# EasyEDA Pro project ADA4530_2025-03-15.epro, board PCB6
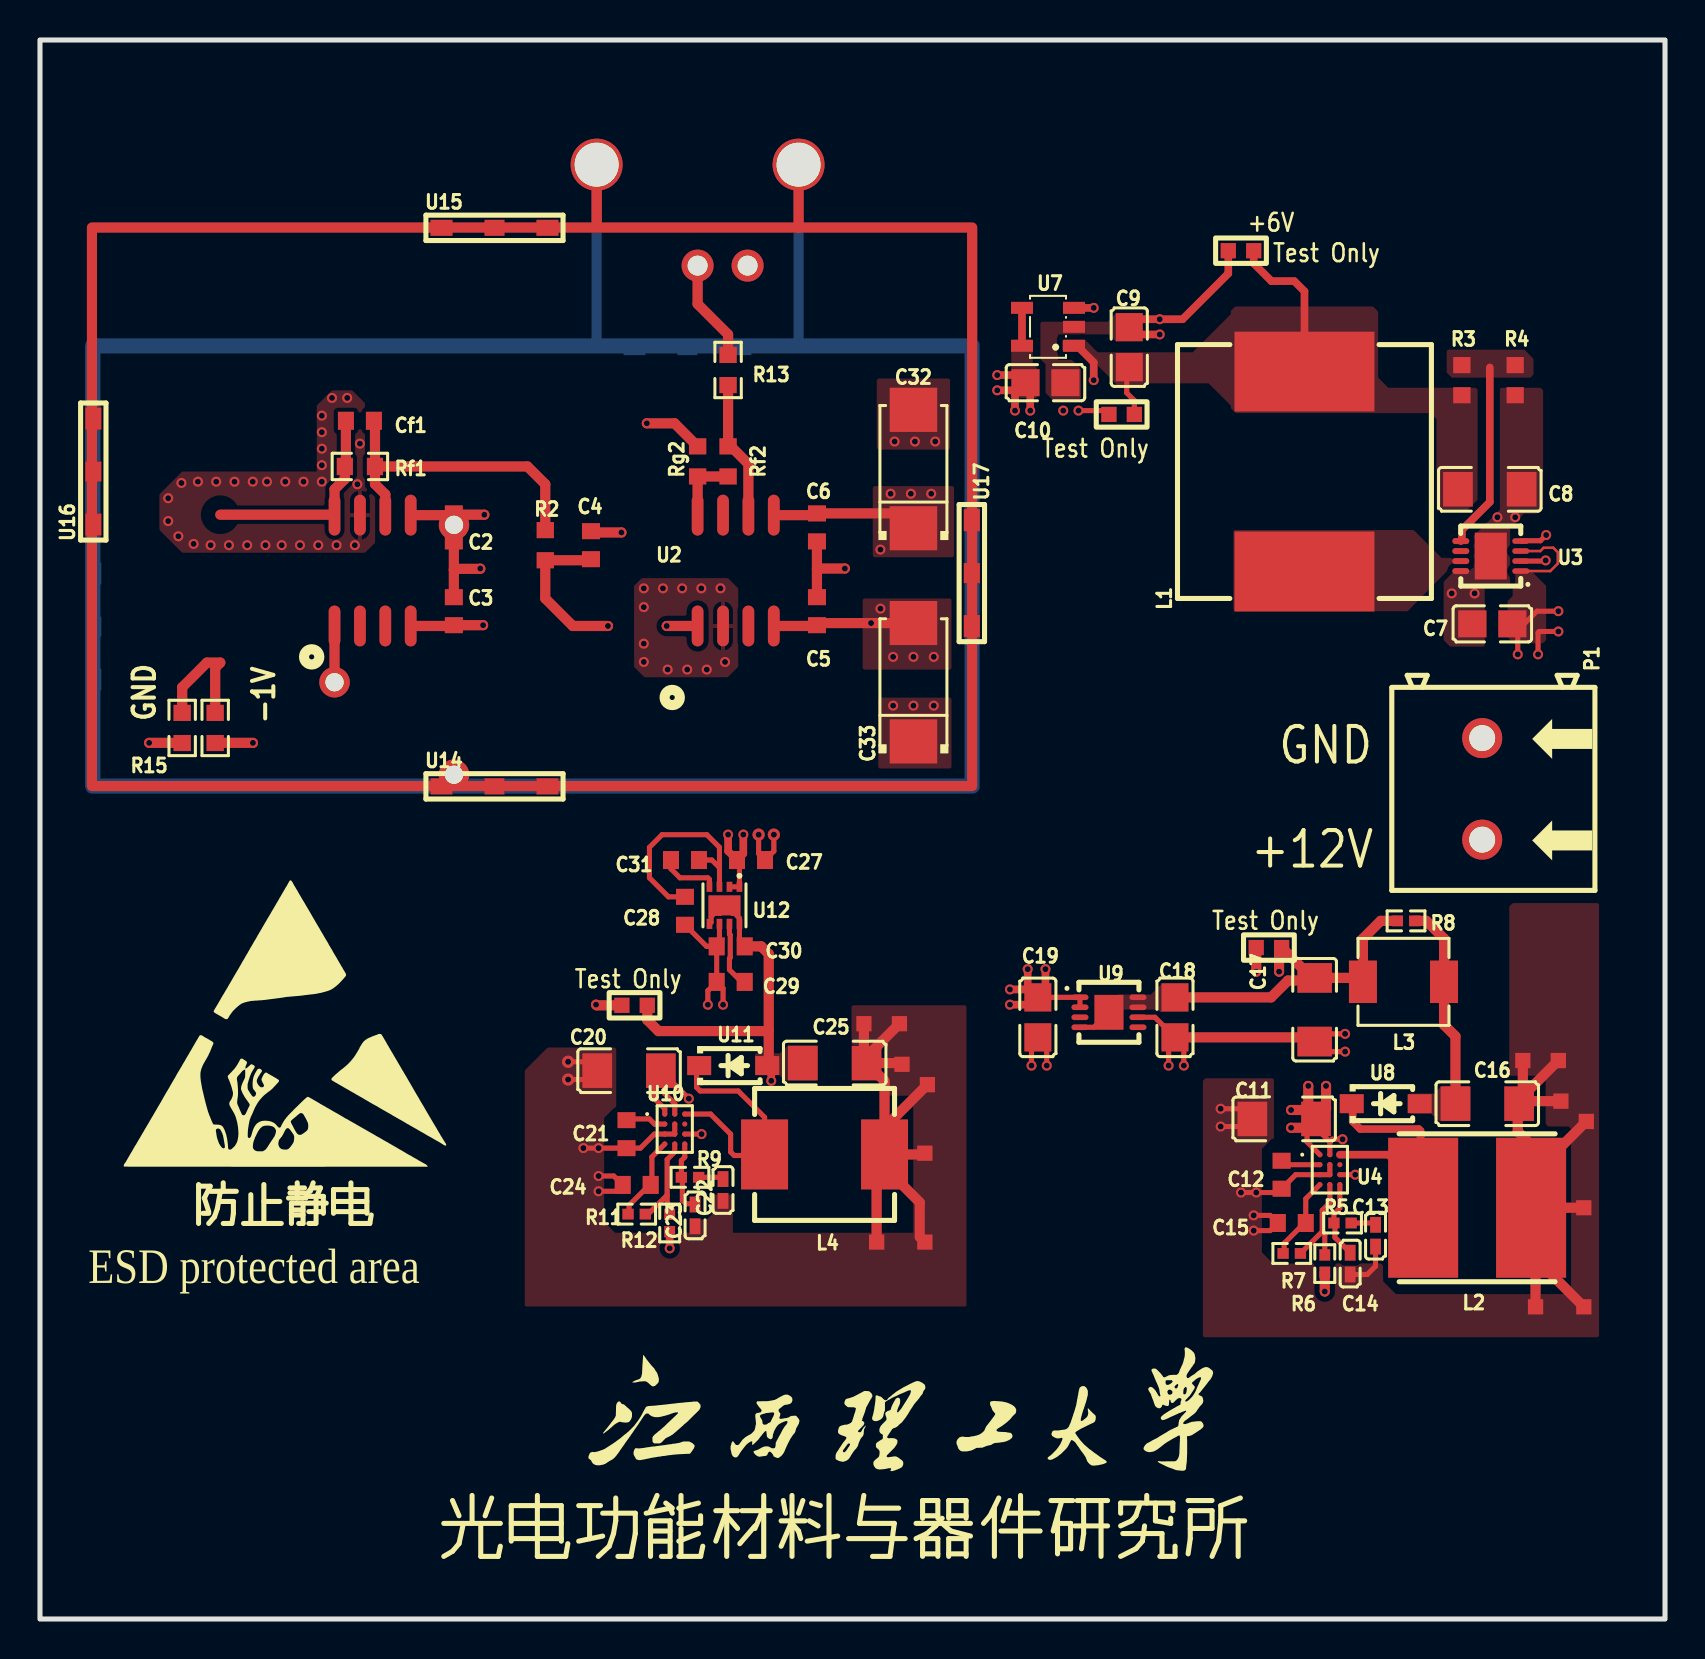
[diagram p8: board, top side]
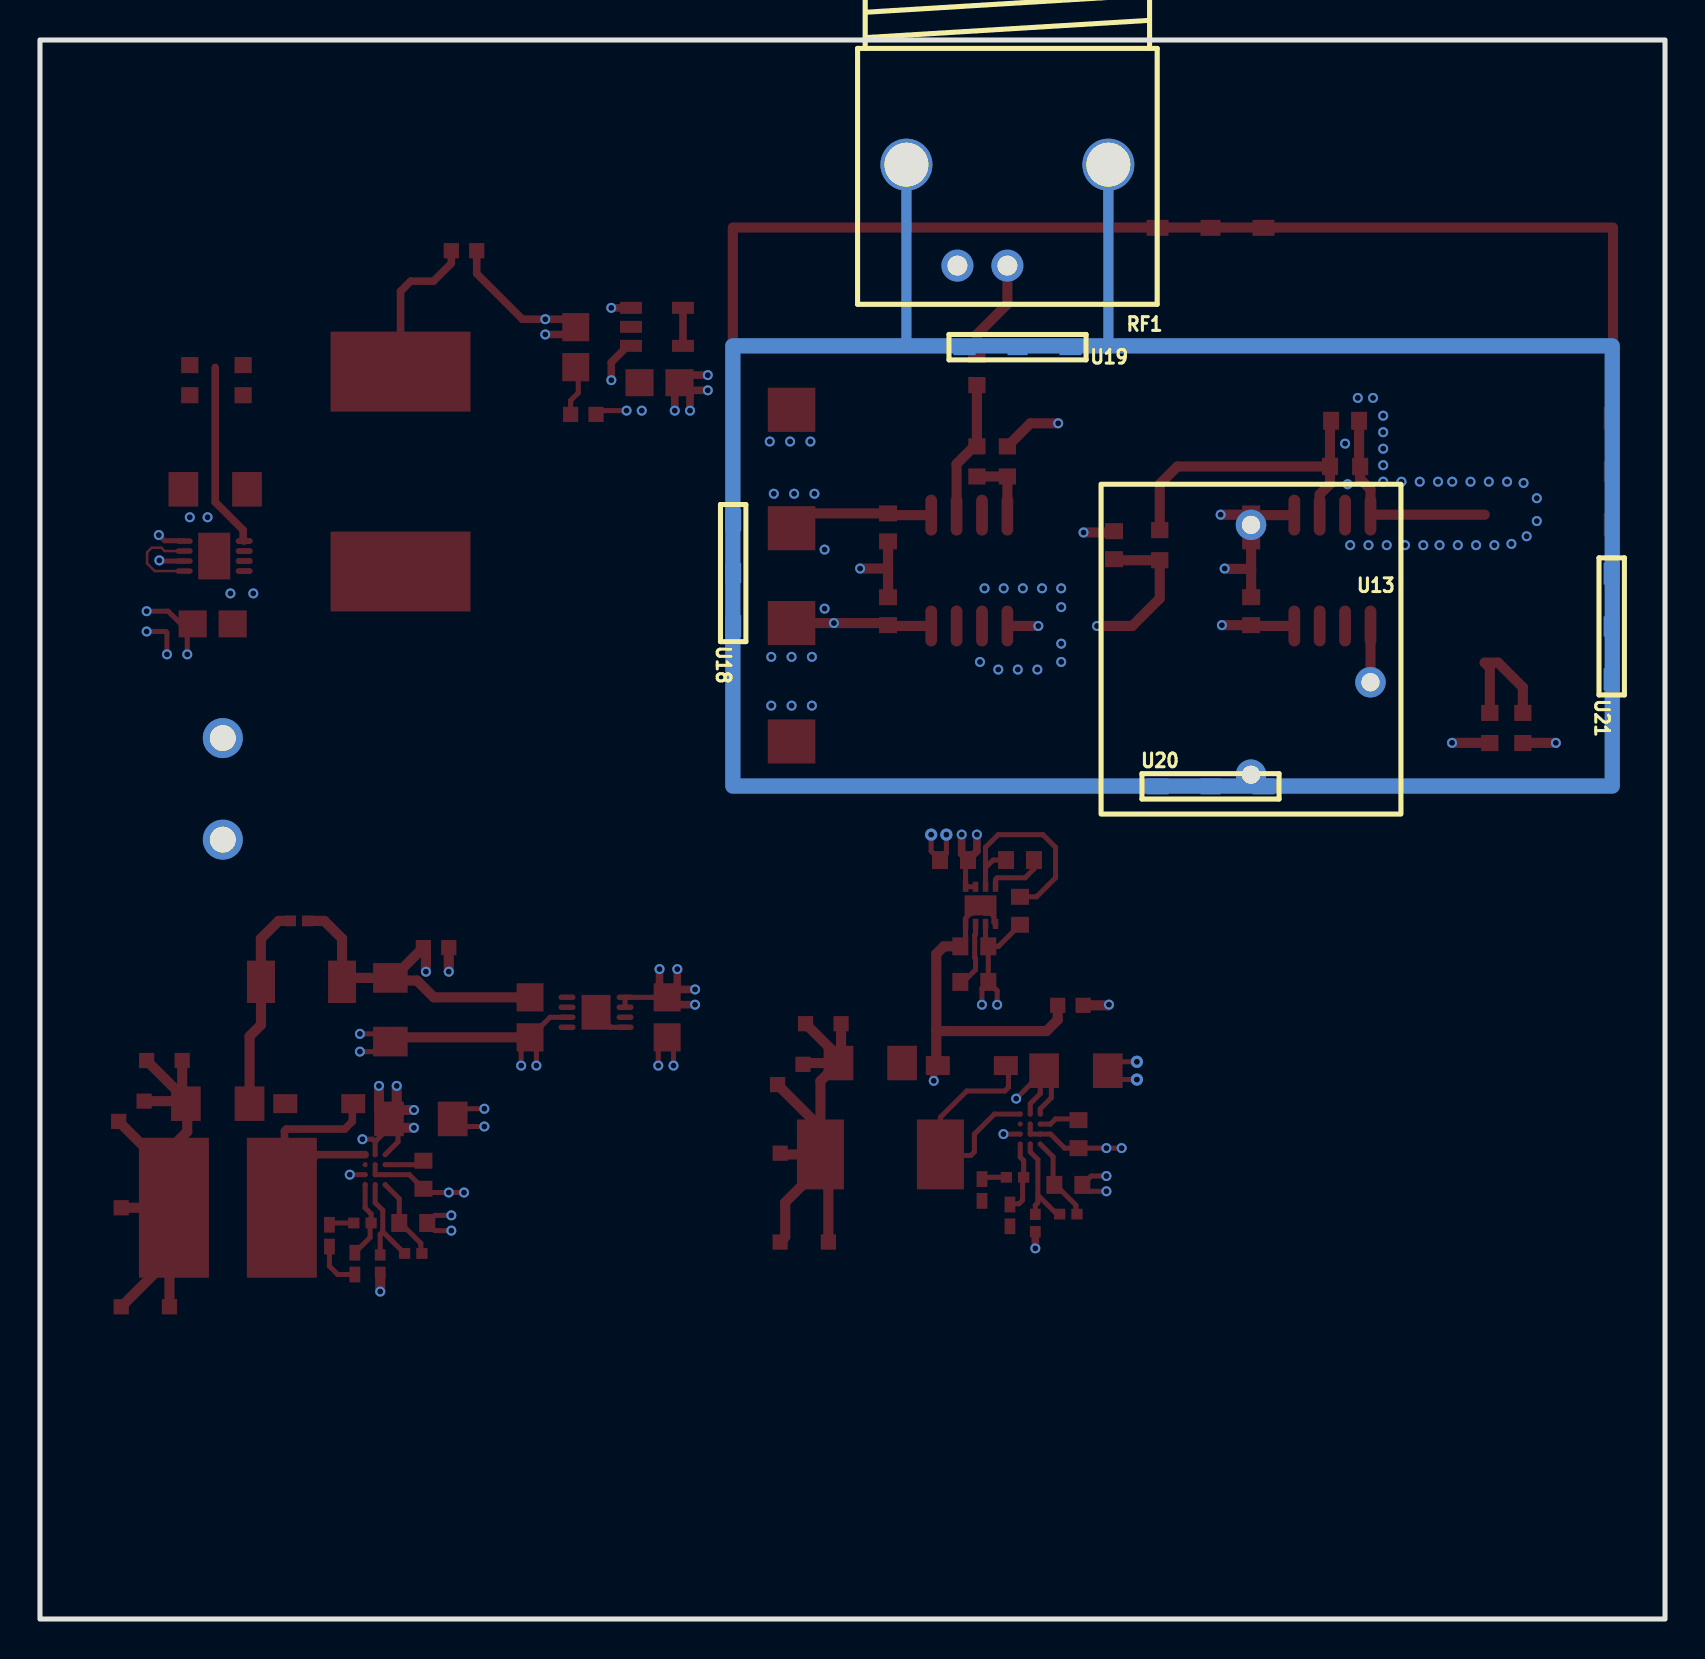
[diagram p9: board, bottom side, seen from below]

Outline 81.28 x 78.99 mm; copper layers: Top Layer, 内层1-AGND, 内层2-SIGNAL, 内层3-POWER, 内层4-agnd, Bottom Layer. Coordinates in mm from the lower left corner of the outline.
Outline path: rectangle 0,78.99 81.28,0
Stack: Top Layer 0.035mm 外层铜厚1oz / Dielectric1 0.0994mm 3313 RC57% 4.2mil / 内层1-AGND 0.0152mm 内层铜厚 / Dielectric2 0.55mm 0.55mm H/H No copper / 内层2-SIGNAL 0.0152mm 内层铜厚 / Dielectric3 0.1088mm 2116 RC54% 4.9mil / 内层3-POWER 0.0152mm 内层铜厚 / Dielectric4 0.55mm 0.55mm H/H No copper / 内层4-agnd 0.0152mm 内层铜厚 / Dielectric5 0.0994mm 3313 RC57% 4.2mil / Bottom Layer 0.035mm 外层铜厚1oz

## Design rules (mm)
template: 自定义配置
spacing copperThickness1oz (default): track to track 0.102, other pairs 0.152 to 0.3
spacing copperThickness2oz: track to track 0.203, other pairs 0.152 to 0.3
track width copperThickness1oz (default): min 0.127, default 0.254, max 2.54
track width copperThickness2oz: min 0.203, default 0.254, max 2.54
differential pair differentialPair (default): width min 0.127, default 0.254, max 2.54; gap min 0.152, default 0.152
via viaSize (default): diameter min 0.5, default 0.61, max 10; hole min 0.3, default 0.305, max 6.299
net AGND uses 全连
net +5V uses 全连
net -5V uses 全连
net +12V uses 全连
net $1N1826 uses 全连
net $1N4287 uses 全连
net $1N4478 uses 全连
net $1N8371 uses 全连
net -1V uses 全连
net $1N1986 uses 全连
net GRD2 uses GRD
net $1N16099 uses 全连
pour e1380 uses GRD

## Placement (name value [footprint] x y rotation side)
C2  100nF  [C0603]  20.7 54.61 270 top
C3  100nF  [C0603]  20.7 50.42 90 top
C4  1nF  [C0603]  27.56 53.72 270 top
C5  100nF  [C0603]  38.86 50.42 270 top
C6  100nF  [C0603]  38.86 54.61 90 top
C7  2.2uF  [C0805]  72.64 49.78 180 top
C8  10uF  [C1206]  72.52 56.52 180 top
C9  2.2uF  [C0805]  54.48 63.63 270 top
C10  2.2uF  [C0805]  50.29 61.85 180 top
C11  10uF  [C1206]  62.23 25.02 0 top
C12  1uF  [C0603]  62.1 22.23 90 top
C13  6.8nF  [C0402]  66.8 19.18 270 top
C14  27pF  [C0402]  65.53 17.78 270 top
C15  1uF  [C0603]  62.61 19.81 0 top
C16  10uF  [C1206]  72.39 25.78 180 top
C17  10uF  [C1206]  63.75 30.48 90 top
C18  2.2uF  [C0805]  56.77 30.1 90 top
C19  2.2uF  [C0805]  49.91 30.1 90 top
C20  10uF  [C1206]  29.46 27.43 0 top
C21  1uF  [C0603]  29.34 24.26 90 top
C22  5.6nF  [C0402]  34.16 21.46 90 top
C23  33pF  [C0402]  32.77 20.19 270 top
C24  1uF  [C0603]  29.84 21.72 0 top
C25  47uF  [C1206]  39.75 27.81 180 top
C27  4.7uF  [C0603]  35.56 37.97 180 top
C28  1uF  [C0603]  32.26 35.43 90 top
C29  1uF  [C0603]  34.55 31.87 0 top
C30  4.7uF  [C0603]  34.55 33.65 0 top
C31  100nF  [C0603]  32.26 37.97 180 top
C32  10uF  [CAP-SMD_L6.0-W3.2]  43.69 57.53 90 top
C33  10uF  [CAP-SMD_L6.0-W3.2]  43.69 46.86 90 top
Cf1  220pF  [C0603]  16 59.94 0 top
L1  18uH  [IND-SMD_L12.7-W12.7]  63.25 57.4 90 top
L2  18uH  [IND-SMD_L7.8-W7.0]  71.88 20.57 180 top
L3  1uH  [IND-SMD_L4.4-W4.2]  68.2 31.88 0 top
L4  10uH  [IND-SMD_L7.3-W6.8]  39.24 23.24 180 top
NOREF  -  [Pad_e879]  77.22 15.62 0 top
NOREF#2  -  [Pad_e1030]  41.21 29.78 0 top
NOREF#3  -  [Pad_e880]  77.34 24.89 0 top
NOREF#4  -  [Pad_e900]  74.17 27.94 0 top
NOREF#5  -  [Pad_e1270]  53.47 60.26 180 top
NOREF#6  -  [Pad_e1036]  41.85 18.86 0 top
NOREF#7  -  [Pad_e902]  76.07 25.91 0 top
NOREF#8  -  [Pad_e1166]  29.1 30.7 180 top
NOREF#9  -  [Pad_e1035]  44.26 18.86 0 top
NOREF#10  -  [Pad_e1032]  43.12 27.75 0 top
NOREF#11  -  [Pad_e1269]  54.74 60.26 180 top
NOREF#12  -  [Pad_e83]  14.73 46.86 0 top
NOREF#13  -  [Pad_e1033]  44.39 26.73 0 top
NOREF#14  -  [Pad_e872]  77.22 20.57 0 top
NOREF#15  -  [Pad_e901]  75.95 27.94 0 top
NOREF#16  -  [Pad_e616]  60.71 68.45 180 top
NOREF#17  -  [Pad_e878]  74.8 15.62 0 top
NOREF#18  -  [Pad_e658]  60.83 33.59 180 top
NOREF#19  -  [Pad_e1167]  30.37 30.7 180 top
NOREF#20  -  [Pad_e618]  59.44 68.45 180 top
NOREF#21  -  [Pad_e1031]  42.99 29.78 0 top
NOREF#22  -  [Pad_e1034]  44.26 23.3 0 top
NOREF#23  -  [Pad_e659]  62.1 33.59 180 top
P1  WJ500V-5.08-2P  [CONN-TH_2P-P5.00_WJ500V-5.08-2P]  72.14 41.53 270 top
R2  1.58kR  [R0603]  25.27 53.72 270 top
R3  221kΩ  [R0603]  71.12 61.98 270 top
R4  34kΩ  [R0603]  73.79 61.98 90 top
R5  12.7kΩ  [R0402]  65.15 19.81 0 top
R6  90.9kΩ  [R0402]  64.26 17.78 270 top
R7  10.7kΩ  [R0402]  62.61 18.29 0 top
R8  12.1Ω  [R0402]  68.33 34.93 180 top
R9  9.76kΩ  [R0402]  32.51 22.1 0 top
R11  39.2kΩ  [R0402]  29.84 20.26 0 top
R12  137kΩ  [R0402]  31.5 19.81 270 top
R13  499Ω  [R0603]  34.42 62.48 90 top
R14  0Ω  [R0603]  8.76 44.58 90 top
R15  0Ω  [R0603]  7.11 44.58 90 top
Rf1  9.76kΩ  [R0603]  16 57.66 0 top
RF1  KH-BNC50-3511  [ANT-TH_KH-BNC50-3511]  32.89 70.23 0 bottom
Rf2  2.8kΩ  [R0603]  34.42 57.91 90 top
Rg2  392Ω  [R0603]  32.89 57.91 270 top
U1  ADA4530-1ARZ  [SOIC-8_L4.9-W3.9-P1.27-LS6.0-BL]  16.64 52.45 0 top
U2  ADA4530-1ARZ  [SOIC-8_L4.9-W3.9-P1.27-LS6.0-BL]  34.8 52.45 0 top
U3  ADP2370ACPZ-R7  [LFCSP-8_L3.0-W3.0-P0.50-BL-EP_ADP2370ACPZ-R7]  72.57 53.18 90 top
U4  ADP5075ACBZ-R7  [WLCSP-12_L2.2-W1.6_ADP5075ACBZ-R7]  64.52 22.48 0 top
U7  ADP7118AUJZ-5.0-R7  [SOT-23-5_L3.0-W1.7-P0.95-LS2.8-BR]  50.42 64.64 0 top
U8  MBR0520L  [SOD-123_L2.7-W1.6-LS3.7-RD-1]  67.31 25.78 0 top
U9  ADP7182ACPZ-5.0-R7  [LFCSP-8_L3.0-W3.0-P0.50-BL-EP-1]  53.47 30.35 270 top
U10  ADP5075ACBZ-R7  [WLCSP-12_L2.2-W1.6_ADP5075ACBZ-R7]  31.75 24.51 0 top
U11  MBR0520L  [SOD-123_L2.7-W1.6-LS3.7-RD-1]  34.67 27.69 0 top
U12  ADP7185ACPZN1.0-R7  [LFCSP-8_L2.0-W2.0-P0.50-BL-EP]  34.24 35.7 180 top
U13  -  [S1227-1010BR]  13.21 56.77 270 bottom
U14  ICSRC6508-030SFR  [SMD-3P_L6.5-W0.8_ICSRC6508-030SFR]  22.73 41.66 0 top
U15  ICSRC6508-030SFR  [SMD-3P_L6.5-W0.8_ICSRC6508-030SFR]  22.73 69.6 0 top
U16  ICSRC6508-030SFR  [SMD-3P_L6.5-W0.8_ICSRC6508-030SFR]  2.67 57.4 90 top
U17  ICSRC6508-030SFR  [SMD-3P_L6.5-W0.8_ICSRC6508-030SFR]  46.61 52.32 270 top
U18  ICSRC6508-030SFR  [SMD-3P_L6.5-W0.8_ICSRC6508-030SFR]  46.61 52.32 90 bottom
U19  ICSRC6508-030SFR  [SMD-3P_L6.5-W0.8_ICSRC6508-030SFR]  32.39 63.63 0 bottom
U20  ICSRC6508-030SFR  [SMD-3P_L6.5-W0.8_ICSRC6508-030SFR]  22.73 41.66 180 bottom
U21  ICSRC6508-030SFR  [SMD-3P_L6.5-W0.8_ICSRC6508-030SFR]  2.67 49.66 90 bottom

## Footprints (pads in the part's own frame, mm; a bottom-side part is the same pattern mirrored in y, then rotated)
ANT-TH_KH-BNC50-3511
  round 1.6 hole 1: 1(0,2.525) 2(2.5,2.525)
  round 2.601 hole 2.2: 3(5.05,-2.525) 4(-5.05,-2.525)
C0402
  rect 0.79x0.54 smd: 1(-0.545,0) 2(0.545,0)
C0603
  rect 0.8x0.9 smd: 1(-0.7,0) 2(0.7,0)
C0805
  rect 1.41x1.35 smd: 1(-1,0) 2(1,0)
C1206
  rect 1.485x1.728 smd: 1(-1.593,0) 2(1.593,0)
CAP-SMD_L6.0-W3.2
  rect 2.208x2.376 smd: 1(-2.962,0) 2(2.962,0)
CONN-TH_2P-P5.00_WJ500V-5.08-2P
  round 2 hole 1.3: 1(-2.54,0) 2(2.54,0)
IND-SMD_L4.4-W4.2
  rect 1.4x2.12 smd: 1(2.028,0) 2(-2.028,0)
IND-SMD_L7.3-W6.8
  rect 2.35x3.5 smd: 1(-3,0) 2(3,0)
IND-SMD_L7.8-W7.0
  rect 3.5x7 smd: 1(-2.7,0) 2(2.7,0)
IND-SMD_L12.7-W12.7
  rect 4x7 smd: 1(-5,0) 2(5,0)
LFCSP-8_L2.0-W2.0-P0.50-BL-EP
  rect 0.28x0.505 smd: 1(-0.75,-0.927) 2(-0.25,-0.927) 3(0.25,-0.927) 4(0.75,-0.927) 5(0.75,0.927) 6(0.25,0.927) 7(-0.25,0.927) 8(-0.75,0.927)
  rect 1.6x1 smd: 9(0,0)
LFCSP-8_L3.0-W3.0-P0.50-BL-EP-1
  oval 0.28x0.85 smd: 1(-0.75,-1.45) 2(-0.25,-1.45) 3(0.25,-1.45) 4(0.75,-1.45) 5(0.75,1.45) 6(0.25,1.45) 7(-0.25,1.45) 8(-0.75,1.45)
  rect 1.74x1.45 smd: 9(0,0)
LFCSP-8_L3.0-W3.0-P0.50-BL-EP_ADP2370ACPZ-R7
  rect 2.34x1.6 smd: 0(0,0)
  oval 0.28x0.85 smd: 1(-0.75,-1.5) 2(-0.25,-1.5) 3(0.25,-1.5) 4(0.75,-1.5)
  oval 0.3x0.85 smd: 5(0.75,1.5) 6(0.25,1.5) 7(-0.25,1.5) 8(-0.75,1.5)
Pad_e83
  round 1.524 hole 0.914: 1(0,0)
Pad_e616
  rect 0.762x0.762 smd: 1(0,0)
Pad_e618
  rect 0.762x0.762 smd: 1(0,0)
Pad_e658
  rect 0.762x0.762 smd: 1(0,0)
Pad_e659
  rect 0.762x0.762 smd: 1(0,0)
Pad_e872
  rect 0.762x0.762 smd: 1(0,0)
Pad_e878
  rect 0.762x0.762 smd: 1(0,0)
Pad_e879
  rect 0.762x0.762 smd: 1(0,0)
Pad_e880
  rect 0.762x0.762 smd: 1(0,0)
Pad_e900
  rect 0.762x0.762 smd: 1(0,0)
Pad_e901
  rect 0.762x0.762 smd: 1(0,0)
Pad_e902
  rect 0.762x0.762 smd: 1(0,0)
Pad_e1030
  rect 0.762x0.762 smd: 1(0,0)
Pad_e1031
  rect 0.762x0.762 smd: 1(0,0)
Pad_e1032
  rect 0.762x0.762 smd: 1(0,0)
Pad_e1033
  rect 0.762x0.762 smd: 1(0,0)
Pad_e1034
  rect 0.762x0.762 smd: 1(0,0)
Pad_e1035
  rect 0.762x0.762 smd: 1(0,0)
Pad_e1036
  rect 0.762x0.762 smd: 1(0,0)
Pad_e1166
  rect 0.762x0.762 smd: 1(0,0)
Pad_e1167
  rect 0.762x0.762 smd: 1(0,0)
Pad_e1269
  rect 0.762x0.762 smd: 1(0,0)
Pad_e1270
  rect 0.762x0.762 smd: 1(0,0)
R0402
  rect 0.566x0.54 smd: 1(-0.433,0) 2(0.433,0)
R0603
  rect 0.806x0.864 smd: 1(-0.753,0) 2(0.753,0)
S1227-1010BR
  round 1.524 hole 0.914: 1(2.032,-7.5) 2(14.532,-7.5)
SMD-3P_L6.5-W0.8_ICSRC6508-030SFR
  rect 1.1x0.8 smd: 1(-2.65,0) 3(2.65,0)
  rect 1x0.8 smd: 2(0,0)
SOD-123_L2.7-W1.6-LS3.7-RD-1
  rect 1.2x0.95 smd: 1(-1.7,0) 2(1.7,0)
SOIC-8_L4.9-W3.9-P1.27-LS6.0-BL
  oval 0.588x2.045 smd: 1(-1.905,-2.772) 2(-0.635,-2.772) 3(0.635,-2.772) 4(1.905,-2.772) 5(1.905,2.772) 6(0.635,2.772) 7(-0.635,2.772) 8(-1.905,2.772)
SOT-23-5_L3.0-W1.7-P0.95-LS2.8-BR
  rect 1.1x0.6 smd: 1(1.3,-0.95) 2(1.3,0) 3(1.3,0.95) 4(-1.3,0.95) 5(-1.3,-0.95)
WLCSP-12_L2.2-W1.6_ADP5075ACBZ-R7
  round 0.256 smd: A1(-0.5,0.75) A2(0,0.75) A3(0.5,0.75) B1(-0.5,0.25) B2(0,0.25) B3(0.5,0.25) C1(-0.5,-0.25) C2(0,-0.25) C3(0.5,-0.25) D1(-0.5,-0.75) D2(0,-0.75) D3(0.5,-0.75)

## Nets
As in the schematic, except:
AGND: C2.2 C3.2 C4.1 C5.1 C6.1 C7.2 C8.1 C9.1 C10.1 C11.1 C12.1 C13.2 C14.2 C15.1 C16.1 C17.1 C18.1 C19.1 C20.1 C21.1 C22.1 C23.2 C24.1 C25.1 C27.1 C28.1 C29.1 C30.1 C32.2 C33.1 L2.1 L4.1 NOREF.1 NOREF#2.1 NOREF#3.1 NOREF#4.1 NOREF#5.1 NOREF#6.1 NOREF#7.1 NOREF#8.1 NOREF#9.1 NOREF#10.1 NOREF#12.1 NOREF#13.1 NOREF#14.1 NOREF#15.1 NOREF#17.1 NOREF#18.1 NOREF#20.1 NOREF#21.1 NOREF#22.1 P1.1 R4.1 R15.1 RF1.2 RF1.3 RF1.4 Rg2.1 U1.1 U3.0 U3.2 U3.4 U3.8 U4.B2 U4.C1 U4.C2 U7.2 U9.6 U10.B2 U10.C1 U10.C2 U12.6 U14.1 U14.2 U14.3 U15.1 U15.2 U15.3 U16.1 U16.2 U16.3 U17.1 U17.2 U17.3 U18.1 U18.2 U18.3 U19.1 U19.2 U19.3 U20.1 U20.2 U20.3 U21.1 U21.2 U21.3
PD+: R14.2 R15.2 U13.2
PD-: Cf1.1 Rf1.1 U1.8 U13.1
$1N1826: C8.2 C9.2 L1.2 NOREF#11.1 NOREF#16.1 R3.2 U7.1 U7.3
$1N4478: C17.2 C18.2 L3.2 NOREF#23.1 R6.2 R8.2 U9.4 U9.7 U9.8 U9.9
$1N8371: C25.2 C30.2 NOREF#19.1 R12.2 U11.2 U12.5 U12.8 U12.9

Pads without a net: U1 2 3; U2 3 7; U3 6; U4 B3; U9 3 5; U10 B3

## Via types
v1: diameter 0.5, hole 0.3, Top Layer to Bottom Layer, 64 vias
v2: diameter 0.5, hole 0.299, Top Layer to Bottom Layer, 61 vias
v3: diameter 0.61, hole 0.305, Top Layer to Bottom Layer, 4 vias

## Routing (per net, layer and track width the routed paths; a pad name or vN(x,y) marks a point on that pad's centre or on a via; arc(x,y) is an arc through that point)
+5V: length 43.2
  Top Layer w0.381: v1(48.77,60.45) 48.77,61.33 48.91,61.47 v1(47.88,61.47) ; v1(47.88,62.23) 48.91,62.23 C10.2 49.53,61.61 v1(49.53,60.45) ; U7.4 U7.5
  Top Layer w0.508: C32.1 42.95,55.31 C6.2 38.78,55.22 U2.5 ; U1.5 20.61,55.22 C2.1 20.77,55.25 v2(22.23,55.25)
  内层3-POWER w0.508: v2(22.23,55.25) 28.45,61.47 37.37,61.47 v2(42.55,56.29)
  vias: v2(42.04,53.5) v2(43.56,56.29) v2(44.58,56.29)
+12V: length 32.4
  Top Layer w0.127: U3.3 75.04,53.43 75.21,53.59 75.69,53.59 75.92,53.37 75.92,52.81 75.54,52.43 U3.1
  Top Layer w0.254: U10.A2 31.75,25.78 31.25,26.28 31.25,27.24 ; U10.A1 31.25,25.52 30.7,26.07 30.7,26.68 31.25,27.24 ; v1(75.95,49.4) 74.99,49.4 74.93,49.34 v1(74.93,48.26) ; 63.37,24.57 63.37,23.87 U4.A1 ; U10.C3 33.09,24.26 v1(33.09,24.26) ; v1(65.15,24) 64.64,24 64.52,23.88 ; 64.52,23.88 63.82,24.57 C11.2 ; 64.52,23.88 U4.A2 ; 31.25,27.24 31.06,27.43 ; 31.25,27.24 v1(32.45,26.03) ; U4.C3 v1(65.79,22.23) ; v1(75.95,50.42) 74.87,50.42 73.91,49.46 v1(73.91,48.26)
  Top Layer w0.508: v1(63.44,26.67) 63.44,25.41 63.38,25.46 v1(62.58,25.46) ; v1(64.33,26.67) 64.33,25.52 C11.2 63.38,24.57 v1(62.58,24.57)
  内层2-SIGNAL w0.254: v1(32.45,26.03) 33.09,25.4 v1(33.09,24.26) ; v1(65.15,24) 65.79,23.37 v1(65.79,22.23)
-1V: length 6.3
  Top Layer w0.254: 34.49,36.63 34.99,36.63 34.99,37.85 C27.2
  Top Layer w0.381: v1(35.18,39.24) 35.18,38.29 C27.2 34.42,38.42 v1(34.42,39.24)
  Top Layer w0.508: 9.14,43.83 v2(10.65,43.83)
-5V: length 43.3
  Top Layer w0.254: C19.2 52.01,31.1 U9.1 U9.2
  Top Layer w0.381: v1(49.4,32.51) 49.4,31.61 49.51,31.5 v1(48.51,31.5) ; v1(48.51,30.73) 49.55,30.73 C19.2 50.29,31.48 v1(50.29,32.51)
  Top Layer w0.508: U1.4 20.66,49.68 C3.1 v2(22.16,49.72) ; U2.4 38.82,49.68 ; C5.2 38.97,49.82 v1(41.57,49.82) C33.2
  内层3-POWER w0.508: v1(41.57,49.82) 40.51,48.77 40.51,47.24 38.48,45.21 26.54,45.21 25.65,46.1 25.65,47.37 24.89,48.13 23.62,48.13 22.16,49.59 v2(22.16,49.72)
  vias: v1(42.04,50.55) v2(42.67,48.13) v2(43.69,48.13) v2(44.7,48.13)
AGND: length 161.5
  Top Layer w0.254: C29.1 33.4,31.43 v1(33.4,30.73) ; C29.1 C30.1 ; C29.1 34.17,31.55 v1(34.17,30.73) ; U10.B2 U10.C2 U10.C1 30.73,24.26 30.03,23.56 C21.1 ; v1(59.06,24.64) 60.26,24.64 C11.1 60.13,25.53 v1(59.06,25.53) ; v3(36.71,39.24) 36.71,38.41 C27.1 35.94,38.29 v3(35.94,39.24) ; v1(65.28,29.27) 64.14,29.27 C17.1 64.26,28.38 v1(65.28,28.38) ; C18.1 55.77,30.1 U9.6 ; C18.1 57.21,28.65 v1(57.21,27.69) ; C18.1 56.45,28.78 v1(56.45,27.69) ; v3(26.42,27.88) 27.43,27.88 C20.1 27.43,26.99 v3(26.42,26.99) ; v1(27.94,21.4) 28.83,21.4 C24.1 28.7,22.16 v1(27.94,22.16) ; v1(60.71,20.19) 61.53,20.19 C15.1 61.53,19.43 v1(60.71,19.43) ; NOREF#5.1 53.28,60.45 v1(51.94,60.45) ; v1(75.34,54.23) 75.05,53.94 74.09,53.94 ; v1(60.07,21.34) v1(60.83,21.34) 61.91,21.34 C12.1 62.81,22.23 U4.C1 U4.C2 U4.B2 ; v1(49.59,27.69) 49.59,28.78 C19.1 50.36,28.65 v1(50.36,27.69) ; U3.2 75.28,52.93 v1(75.31,52.96) ; C14.2 66.38,17.24 66.8,17.65 C13.2 ; v1(27.18,23.56) v1(27.94,23.56) 29.34,23.56 ; C28.1 33.34,33.65 C30.1 ; C30.1 33.99,33.79 U12.6
  Top Layer w0.381: NOREF#20.1 59.44,67.31 57.15,65.02 v1(56.01,65.02) 54.88,65.02 C9.1 54.85,64.26 v1(56.01,64.26)
  Top Layer w0.508: NOREF#22.1 44.2,23.24 L4.1 ; L4.1 41.85,22.84 NOREF#6.1 ; L4.1 42.24,24.59 ; L4.1 42.24,22.61 44.01,20.84 44.01,19.11 NOREF#9.1 ; C25.1 41.34,28.14 NOREF#21.1 ; C25.1 43.05,27.81 NOREF#10.1 ; C25.1 42.24,26.91 42.24,24.59 ; C25.1 41.21,27.95 NOREF#2.1 ; NOREF#15.1 74.04,26.04 73.91,26.04 74.17,26.29 NOREF#4.1 ; 6.98,43.83 v2(5.46,43.83) ; 74.08,25.87 C16.1 73.91,25.71 73.91,24.38 74.58,23.72 74.58,22.13 NOREF#3.1 ; v1(27.81,30.73) 27.84,30.7 NOREF#8.1 ; Rg2.1 31.74,59.82 v1(30.35,59.82) ; 22.02,52.54 20.74,52.54 20.7,52.49 ; 20.7,52.49 C2.2 ; 20.7,52.49 C3.2 ; C4.1 27.62,54.36 v1(29.08,54.36) ; NOREF.1 74.8,18.03 NOREF#17.1 ; C17.1 63.54,29.1 C18.1 ; 42.24,24.59 NOREF#13.1 ; 38.86,52.54 38.88,52.55 v1(40.26,52.55) ; 38.86,52.54 C5.1 ; 38.86,52.54 C6.1 ; NOREF#14.1 L2.1 ; NOREF#12.1 U1.1 ; RF1.4 27.84,69.72 ; NOREF#7.1 74.11,25.91 ; RF1.3 37.94,69.6 ; v1(60.83,32.39) NOREF#18.1
  Bottom Layer w0.508: RF1.3 37.94,63.75 ; RF1.4 27.84,63.63
  vias: v1(22.02,52.55) v1(51.18,60.45) v1(70.61,51.31) v1(71.75,51.31) v1(72.9,55.12) v1(73.79,55.12) v2(42.75,58.91) v2(42.67,45.69) v2(43.76,58.91) v2(43.69,45.69) v2(44.7,45.69) v2(44.78,58.91)
FB: length 5.3
  Top Layer w0.254: R6.1 64.26,19.25 64.14,19.38 ; 64.14,19.38 R7.2 ; 64.14,19.38 64.14,20.45 64.52,20.83 U4.D2
FB2: length 5.2
  Top Layer w0.254: 31.37,21.21 31.37,20.83 31.5,20.7 R12.1 ; 31.37,21.21 30.42,20.26 R11.2 ; 31.37,21.21 31.37,22.99 31.75,23.37 U10.D2
GRD1:
  vias: v2(6.41,56.07) v2(6.41,54.93) v2(6.92,54.17) v2(7.07,56.83) v2(7.68,53.78) v2(7.9,56.9) v2(8.53,53.72) v2(8.81,56.9) v2(9.45,53.72) v2(9.73,56.9) v2(10.36,53.72) v2(10.64,56.9) v2(11.35,56.9) v2(11.28,53.72) v2(12.09,53.72) v2(12.27,56.9) v2(13.01,53.72) v2(13.18,56.9) v2(13.92,53.72) v2(14.1,60.2) v2(14.1,59.37) v2(14.1,58.55) v2(14.1,57.72) v2(14.1,56.9) v2(14.61,61.09) v2(14.83,53.72) v2(15.37,61.09) v2(15.75,53.72) v2(15.88,56.77) v2(16,58.8)
GRD2:
  vias: v2(30.2,51.56) v2(30.2,50.62) v2(30.2,48.79) v2(30.2,47.88) v2(31.16,51.56) v2(31.39,47.5) v2(32.12,51.56) v2(32.37,47.5) v2(33.08,51.56) v2(33.35,47.5) v2(34.04,51.56) v2(34.26,47.88)
PD+: length 6.3
  Top Layer w0.508: R14.2 8.76,47.59 9.02,47.85 8.35,47.85 7.11,46.61 R15.2
PD-: length 10.7
  Top Layer w0.508: 9.02,55.25 14.71,55.25 U1.8 14.73,56.52 15.25,57.03 Rf1.1 15.3,57.71 Cf1.1
SIGNAL_OUT: length 6.8
  Top Layer w0.508: 34.42,61.48 Rf2.2 34.55,58.67 35.43,57.79 U2.6
SW: length 13.1
  Top Layer w0.127: L2.2 69.05,20.71 69.05,21.63
  Top Layer w0.381: U4.A3 67.45,23.23 69.05,21.63 69.05,24.42 68.96,24.51 66.04,24.51 65.66,24.89 65.66,25.73 U8.1
SW2: length 12.4
  Top Layer w0.254: U10.A3 33.54,25.26 34.54,24.26 34.54,23.37 34.72,23.19 36.19,23.19 L4.2 36.24,25.1 34.93,26.42 33.02,26.42 32.84,26.6 32.84,27.56 U11.1
VREF: length 4.2
  Top Layer w0.254: U4.D1 63.31,21.02 C15.2 63.25,19.81 62.23,18.8 62.23,18.34 62.18,18.29
VREF2: length 4.3
  Top Layer w0.254: R11.1 29.46,20.31 29.46,20.7 30.48,21.72 C24.2 30.61,21.78 30.61,23.12 U10.D1
$1N373: length 16.1
  Top Layer w0.508: Rf1.2 16.76,56.78 17.27,56.26 U1.6 ; Rf1.2 16.76,59.89 Cf1.2 ; Rf1.2 24.38,57.66 25.27,56.77 R2.1
$1N731: length 12.4
  Top Layer w0.508: v2(31.35,49.68) U2.1 ; C4.2 27.51,52.97 R2.2 25.27,51.05 26.65,49.68 v2(28.41,49.68)
  内层2-SIGNAL w0.508: v2(28.41,49.68) v2(31.35,49.68)
$1N896: length 3.5
  Top Layer w0.508: U2.8 Rg2.2 Rf2.1
$1N1826: length 16.5
  Top Layer w0.254: C9.2 54.36,62.5 54.36,61.34 54.74,60.96 NOREF#11.1
  Top Layer w0.381: 63.25,63.08 63.25,66.42 62.74,66.93 61.59,66.93 60.71,67.82 NOREF#16.1 ; U7.3 v1(52.71,65.59) ; U7.1 51.88,63.69 52.71,62.87 v1(52.71,61.98)
  内层1-AGND w0.381: v1(52.71,65.59) v1(52.71,61.98)
$1N3114: length 2
  Top Layer w0.254: C12.2 62.3,22.73 U4.B1
$1N3352: length 1.3
  Top Layer w0.254: R5.2 66.71,19.81 C13.1
$1N3356: length 3.9
  Top Layer w0.254: C14.1 64.77,19.09 64.77,19.76 R5.1 64.72,20.27 65.02,20.57 U4.D3
$1N4287: length 10.3
  Top Layer w0.508: C16.2 70.8,29.15 70.23,29.72 L3.1 70.23,31.88 70.23,34.04 69.34,34.93 R8.1
$1N4478: length 38.9
  Top Layer w0.254: U9.4 52.72,29.6 U9.9
  Top Layer w0.508: C17.2 65.98,32.07 L3.2 66.17,34.04 67.06,34.93 R8.2 ; R6.2 v1(64.26,16.38) ; v1(61.98,32.39) 61.98,33.46 NOREF#23.1 63.75,31.94 62.42,31.94 61.58,31.1 C18.2
  内层2-SIGNAL w0.381: v1(61.98,32.39) 61.34,31.75 61.34,23.88 63.14,22.08 63.14,16.36 63.5,16 63.88,16 v1(64.26,16.38)
$1N6954: length 1.3
  Top Layer w0.254: C22.2 34.07,22.1 R9.2
$1N6955: length 3.6
  Top Layer w0.254: C23.1 32.73,20.78 32.31,20.78 32.13,20.96 32.13,22.05 R9.1 32.08,22.94 32.25,23.11 U10.D3
$1N8371: length 32.1
  Top Layer w0.254: U12.5 33.57,34.86 33.57,35.14 33.73,35.31 34.02,35.31 34.24,35.53 U12.9 34.63,35.31 34.74,35.31 34.99,35.06 U12.8 34.99,33.91 C30.2
  Top Layer w0.381: U11.2 36.58,27.48 v1(36.58,26.92) ; R12.2 v1(31.5,18.54)
  Top Layer w0.508: 36.45,29.41 30.93,29.41 30.37,29.97 NOREF#19.1 ; 36.45,29.41 36.45,27.76 U11.2 ; 36.45,29.41 36.45,33.27 36.07,33.65 C30.2
  内层2-SIGNAL w0.381: v1(36.58,26.92) 35.94,26.92 34.16,25.15 34.16,19.18 33.02,18.03 32,18.03 v1(31.5,18.54)
$1N8567: length 10.9
  Top Layer w0.254: 33.99,36.63 33.99,37.59 ; 33.99,37.59 33.99,38.6 33.35,39.24 31.12,39.24 30.48,38.6 30.48,37.08 31.43,36.13 C28.2 ; 33.99,37.59 33.61,37.97 C31.1
$1N8625: length 3.3
  Top Layer w0.254: C29.2 35.09,31.87 34.49,32.48 34.49,33.05 34.53,33.09 34.53,34.22 34.49,34.26 U12.7
$1N8812: length 3
  Top Layer w0.254: C31.2 31.56,37.53 32.01,37.08 33.4,37.08 33.49,37 33.49,36.63
$1N16099: length 9.3
  Top Layer w0.381: U3.5 71.12,53.98 71.12,54.48 72.52,55.88 72.52,62.61
$1N25161: length 4.9
  Top Layer w0.508: RF1.1 32.89,65.79 34.42,64.26 34.42,63.48
$1N25879: length 2
  Top Layer w0.254: U10.B1 30.74,24.76 30.48,25.02 29.4,25.02 C21.2

## Copper pours and planes (outline as drawn; the poured copper is in the pictures)
+5V on Top Layer: 45.72,53.12 41.66,53.12 41.66,56.68 45.72,56.68
+5V on Top Layer: 49.66,64.01 49.66,62.78 49.89,62.55 49.89,61.09 48.58,61.09 48.58,64.01
+5V on 内层3-POWER: 41.28,52.97 52.97,52.97 55.87,55.87 55.87,62.59 53.09,65.37 53.09,65.41 41.28,65.41
+12V on Top Layer: 73.66,52.58 74.44,52.58 75.33,51.69 75.33,48.97 75.18,48.82 73.7,48.82 73.41,49.11 73.41,50.93 73.66,51.18
+12V on 内层3-POWER: 0,78.99 81.28,78.99 81.28,0 0,0
-1V on 内层3-POWER: 10.16,49.4 11.05,48.51 11.05,45.47 12.57,43.94 35.69,43.94 40.51,39.12 40.51,31.53 37.97,28.99 8.17,28.99 6.73,30.43 6.73,48.01 8.13,49.4
-5V on Top Layer: 41.15,51.05 45.59,51.05 45.59,47.5 41.15,47.5
-5V on 内层3-POWER: 41.28,51.18 41.28,47.5 47.97,47.5 47.97,28.91 55.87,28.91 55.87,48.27 52.96,51.18
AGND on Top Layer: 52.07,64.9 53.41,64.9 53.82,65.31 55.09,65.31 55.12,65.28 55.12,63.94 53.91,63.94 53.85,63.88 53.46,64.27 52.08,64.27 52.07,64.27
AGND on Top Layer: 41.93,46.1 45.59,46.1 45.59,42.55 41.93,42.55
AGND on Top Layer: 71.82,52.58 72.26,52.14 72.26,48.64 70.54,48.64 70.21,48.97 70.21,52.17 70.61,52.58
AGND on Top Layer: 33.66,21.24 34.66,21.24 34.66,19.04 32.76,19.04 32.51,18.8 32.51,19.99 33.36,19.99 33.71,20.34 33.71,21.19
AGND on Top Layer: 52.2,64.9 50.04,64.9 50.04,63.03 50.29,62.78 50.29,61.35 50.69,60.95 51.93,60.95 52.07,61.09 52.07,62.53 51.61,62.99 50.93,62.99 50.93,64.27 52.08,64.27 52.2,64.39
AGND on Top Layer: 28.82,28.59 28.82,25.67 28.95,25.54 28.69,25.54 28.22,25.07 28.22,19.88 28.76,19.33 43.68,19.33 43.68,26.05 43.55,26.18 42.54,26.18 42.41,26.3 42.41,28.59 42.28,28.72 40.59,28.72 40.59,30.71 46.35,30.71 46.35,15.63 24.25,15.63 24.25,27.45 25.39,28.59
AGND on Top Layer: 61.72,27.05 61.72,24.13 61.85,24 61.59,24 61.12,23.53 61.12,18.34 61.67,17.79 67.07,17.79 67.18,17.67 67.18,16.89 67.82,16.26 76.45,16.26 76.58,16.38 76.58,24.51 76.45,24.64 75.44,24.64 75.31,24.77 75.31,27.05 75.18,27.18 73.49,27.18 73.49,35.65 73.66,35.81 77.98,35.81 77.98,14.1 58.17,14.1 58.17,26.92 58.29,27.05
AGND on Top Layer: 73.02,61.6 73.02,55.5 71.71,54.18 71.71,51.68 73.39,51.68 73.53,51.82 73.53,54.61 74.22,55.3 74.85,55.3 75.18,55.63 75.18,61.47 75.06,61.6
AGND on Top Layer: 45.52,58.5 41.86,58.5 41.86,62.05 45.52,62.05
AGND on 内层1-AGND: 0,78.99 81.28,78.99 81.28,0 0,0
AGND on 内层4-agnd: 0,78.99 81.28,78.99 81.28,0 0,0
GRD1 on Top Layer: 7.11,57.4 5.97,56.26 5.97,54.48 7.11,53.34 16.26,53.34 16.76,53.85 16.76,56.13 16.26,56.64 16.26,60.83 15.62,61.47 14.61,61.47 13.84,60.71 13.84,57.4
GRD1 on 内层1-AGND: 7.11,57.4 5.97,56.26 5.97,54.48 7.11,53.34 16.26,53.34 16.64,53.72 16.64,56.13 16.26,56.52 16.26,60.83 15.62,61.47 14.61,61.47 13.84,60.71 13.84,57.4
GRD2 on Top Layer: 30.1,52.07 34.42,52.07 34.93,51.56 34.93,47.64 34.41,47.12 30.23,47.12 29.72,47.63 29.72,51.69
GRD2 on 内层1-AGND: 30.2,52.16 34.39,52.16 34.9,51.65 34.9,47.47 34.64,47.2 30.07,47.2 29.69,47.58 29.69,51.65
$1N1826 on Top Layer: 54.92,63.37 57.66,63.37 59.82,65.53 63.75,65.53 63.88,65.41 63.88,60.36 59.91,60.36 58.45,61.82 54.77,61.82 54.77,63.22
$1N1826 on Top Layer: 52.26,64.01 52.89,63.37 55.25,63.37 55.25,61.85 55.12,61.72 53.89,61.72 52.18,63.43 51.12,63.43 51.12,64.01
$1N1826 on Top Layer: 66.68,65.66 66.93,65.41 66.93,62.1 67.44,61.6 71.81,61.6 71.91,61.5 71.91,56 71.34,55.42 69.93,55.42 69.85,55.5 69.85,60.03 69.55,60.33 59.81,60.33 59.56,60.58 59.56,65.44 59.78,65.66
$1N1986 on Top Layer: 59.69,54.48 68.71,54.48 70.1,53.09 71.37,53.09 71.37,52.67 70.61,52.67 68.41,50.42 59.69,50.42
$1N4287 on Top Layer: 68.45,26.29 69.72,26.29 70.1,26.67 71.56,26.67 71.56,24.92 69.95,24.92 69.6,25.27 68.58,25.27 68.45,25.4
$1N4478 on Top Layer: 53.85,31.24 55.57,31.24 56.08,31.75 57.44,31.75 57.44,30.38 56.16,30.38 56.13,30.35 55.88,30.35 55.75,30.48 54.02,30.48 53.85,30.65
$1N8371 on Top Layer: 35.76,28.31 37.03,28.31 37.41,28.69 38.87,28.69 38.87,26.94 37.26,26.94 36.9,27.29 35.89,27.29 35.76,27.42
$1N16099 on Top Layer: 70.36,63.5 74.25,63.5 74.7,63.05 74.7,62.26 74.55,62.1 70.61,62.1 70.36,62.36

## Text on the board
Top Silkscreen Layer: +6V | Test Only | GND | -1V | +12V | ESD protected area | 防止静电 | 光电功能材料与器件研究所
